# Altium project PCB_Project.PrjPcb
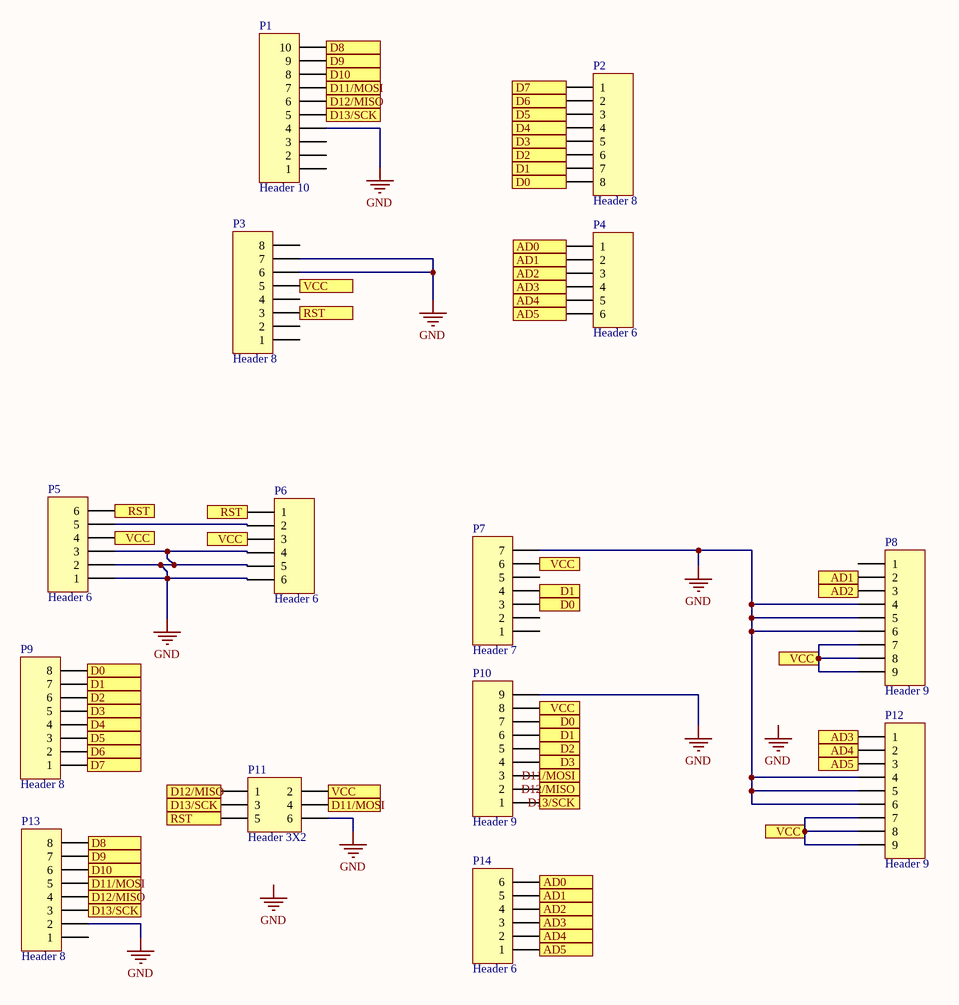
[diagram p0: Sheet2.SchDoc]
1 sheet, 14 parts. Net scope: flat (ports and power ports of the same name join across sheets).
Board file: PCB2.PcbDoc

## Sheet Sheet2.SchDoc
size Tabloid; SheetNumber: 1; SheetTotal: 1

### Parts
P1  Header 10  [HDR1X10]
P2  Header 8  [HDR1X8]
P3  Header 8  [HDR1X8]
P4  Header 6  [HDR1X6]
P5  Header 6  [HDR1X6]
P6  Header 6  [HDR1X6]
P7  Header 7  [HDR1X7]
P8  Header 9  [HDR1X9]
P9  Header 8  [HDR1X8]
P10  Header 9  [HDR1X9]
P11  Header 3X2  [HDR2X3]
P12  Header 9  [HDR1X9]
P13  Header 8  [HDR1X8]
P14  Header 6  [HDR1X6]

### Ports
AD0, AD1, AD2, AD3, AD4, AD5, D0, D1, D2, D3, D4, D5, D6, D7, D8, D9, D10, D11/MOSI, D12/MISO, D13/SCK, RST, VCC

### Nets
GND: P1.4 P3.6 P3.7 P5.1 P5.2 P5.3 P6.4 P6.5 P6.6 P7.7 P8.4 P8.5 P8.6 P10.9 P11.6 P12.4 P12.5 P12.6 P13.2
NetP1_5: P1.5 P10.1 P11.3 P13.3 ; port D13/SCK
NetP1_6: P1.6 P10.2 P11.1 P13.4 ; port D12/MISO
NetP1_7: P1.7 P10.3 P11.4 P13.5 ; port D11/MOSI
NetP1_8: P1.8 P13.6 ; port D10
NetP1_9: P1.9 P13.7 ; port D9
NetP1_10: P1.10 P13.8 ; port D8
NetP2_1: P2.1 P9.1 ; port D7
NetP2_2: P2.2 P9.2 ; port D6
NetP2_3: P2.3 P9.3 ; port D5
NetP2_4: P2.4 P9.4 ; port D4
NetP2_5: P2.5 P9.5 P10.4 ; port D3
NetP2_6: P2.6 P9.6 P10.5 ; port D2
NetP2_7: P2.7 P7.4 P9.7 P10.6 ; port D1
NetP2_8: P2.8 P7.3 P9.8 P10.7 ; port D0
NetP3_3: P3.3 P5.6 P6.1 P11.5 ; port RST
NetP3_5: P3.5 P5.4 P6.3 P7.6 P8.7 P8.8 P8.9 P10.8 P11.2 P12.7 P12.8 P12.9 ; port VCC
NetP4_1: P4.1 P14.6 ; port AD0
NetP4_2: P4.2 P8.2 P14.5 ; port AD1
NetP4_3: P4.3 P8.3 P14.4 ; port AD2
NetP4_4: P4.4 P12.1 P14.3 ; port AD3
NetP4_5: P4.5 P12.2 P14.2 ; port AD4
NetP4_6: P4.6 P12.3 P14.1 ; port AD5
NetP5_5: P5.5 P6.2

Not connected (* = marked no-connect by the designer): P1 1 2 3; P3 1 2 4 8; P7 1 2 5; P8 1; P13 1

### Notes on the sheet
- Labels drawn without touching a wire or pin: GND

### Library data of the parts
P1 = Header 10: Header, 10-Pin; LatestRevisionDate: 17-Jul-2002; LatestRevisionNote: Re-released for DXP Platform.; Publisher: Altium Limited
P2 P3 P9 P13 = Header 8: Header, 8-Pin; LatestRevisionDate: 17-Jul-2002; LatestRevisionNote: Re-released for DXP Platform.; Publisher: Altium Limited
P4-P6 P14 = Header 6: Header, 6-Pin; LatestRevisionDate: 17-Jul-2002; LatestRevisionNote: Re-released for DXP Platform.; Publisher: Altium Limited
P7 = Header 7: Header, 7-Pin; LatestRevisionDate: 17-Jul-2002; LatestRevisionNote: Re-released for DXP Platform.; Publisher: Altium Limited
P8 P10 P12 = Header 9: Header, 9-Pin; LatestRevisionDate: 17-Jul-2002; LatestRevisionNote: Re-released for DXP Platform.; Publisher: Altium Limited
P11 = Header 3X2: Header, 3-Pin, Dual row; LatestRevisionDate: 17-Jul-2002; LatestRevisionNote: Re-released for DXP Platform.; Publisher: Altium Limited